# Altium schematic sheet кошколаз.SchDoc
size A4
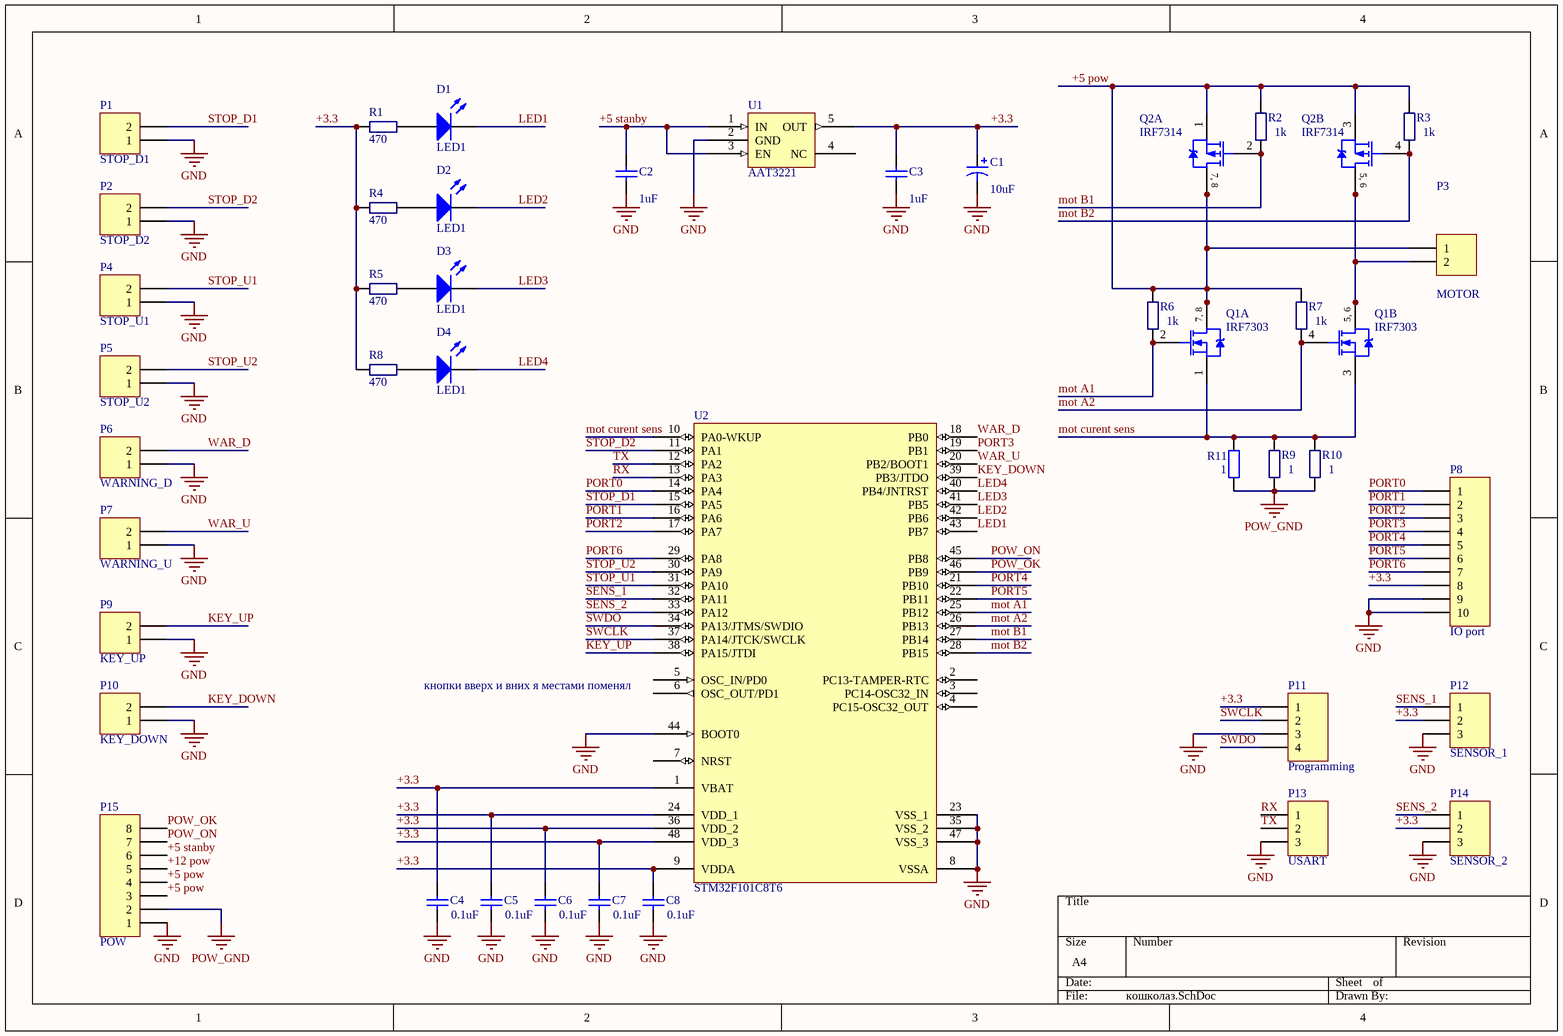
[diagram p0: кошколаз.SchDoc]

## Parts
C1  10uF  [C0805]
C2  1uF  [1608[0603]]
C3  1uF  [1608[0603]]
C4  0.1uF  [1608[0603]]
C5  0.1uF  [1608[0603]]
C6  0.1uF  [1608[0603]]
C7  0.1uF  [1608[0603]]
C8  0.1uF  [1608[0603]]
D1  LED1  [LED-1]
D2  LED1  [LED-1]
D3  LED1  [LED-1]
D4  LED1  [LED-1]
P1  STOP_D1  [HDR1X2]
P2  STOP_D2  [HDR1X2]
P3  MOTOR  [HDR1X2]
P4  STOP_U1  [HDR1X2]
P5  STOP_U2  [HDR1X2]
P6  WARNING_D  [HDR1X2]
P7  WARNING_U  [HDR1X2]
P8  IO port  [HDR1X10]
P9  KEY_UP  [HDR1X2]
P10  KEY_DOWN  [HDR1X2]
P11  Programming  [HDR1X4]
P12  SENSOR_1  [HDR1X3]
P13  USART  [HDR1X3]
P14  SENSOR_2  [HDR1X3]
P15  POW  [HDR1X8]
Q1  IRF7303  [SO-8_N]  (parts A,B of 2)
Q2  IRF7314  [SO-8_N]  (parts A,B of 2)
R1  470  [J1-0603]
R2  1k  [J1-0603]
R3  1k  [J1-0603]
R4  470  [J1-0603]
R5  470  [J1-0603]
R6  1k  [J1-0603]
R7  1k  [J1-0603]
R8  470  [J1-0603]
R9  1  [6-0805_N]
R10  1  [6-0805_N]
R11  1  [AXIAL-0.4]
U1  AAT3221  [SOT23-5]
U2  STM32F101C8T6  [LQFP48_M]

## Nets
GND: C1.2 C2.1 C3.1 C4.1 C5.1 C6.1 C7.1 C8.1 P1.1 P2.1 P4.1 P5.1 P6.1 P7.1 P8.9 P8.10 P9.1 P10.1 P11.3 P12.3 P13.3 P14.3 P15.1 U1.2(GND) U2.8(VSSA) U2.23(VSS_1) U2.35(VSS_2) U2.44(BOOT0) U2.47(VSS_3)
POW_GND: P15.2 R9.1 R10.1 R11.1
+3.3: C1.1 C3.2 C4.2 C5.2 C6.2 C7.2 C8.2 P8.8 P11.1 P12.2 P14.2 R1.2 R4.2 R5.2 R8.2 U1.5(OUT) U2.1(VBAT) U2.9(VDDA) U2.24(VDD_1) U2.36(VDD_2) U2.48(VDD_3)
+5 pow: P3.1 P15.3 P15.4 Q1.7(D) Q1.8(D) Q2.1(S) Q2.3(S) Q2.7(D) Q2.8(D) R2.2 R3.2 R6.2 R7.2
+5 stanby: C2.2 P15.6 U1.1(IN) U1.3(EN)
+12 pow: P15.5
KEY_DOWN: P10.2 U2.39(PB3/JTDO)
KEY_UP: P9.2 U2.38(PA15/JTDI)
LED1: D1.2(K) U2.43(PB7)
LED2: D2.2(K) U2.42(PB6)
LED3: D3.2(K) U2.41(PB5)
LED4: D4.2(K) U2.40(PB4/JNTRST)
mot A1: Q1.2(G) R6.1 U2.25(PB12)
mot A2: Q1.4(G) R7.1 U2.26(PB13)
mot B1: Q2.2(G) R2.1 U2.27(PB14)
mot B2: Q2.4(G) R3.1 U2.28(PB15)
mot curent sens: Q1.1(S) Q1.3(S) R9.2 R10.2 R11.2 U2.10(PA0-WKUP)
PORT0: P8.1 U2.14(PA4)
PORT1: P8.2 U2.16(PA6)
PORT2: P8.3 U2.17(PA7)
PORT3: P8.4 U2.19(PB1)
PORT4: P8.5 U2.21(PB10)
PORT5: P8.6 U2.22(PB11)
PORT6: P8.7 U2.29(PA8)
POW_OK: P15.8 U2.46(PB9)
POW_ON: P15.7 U2.45(PB8)
RX: P13.1 U2.13(PA3)
SENS_1: P12.1 U2.32(PA11)
SENS_2: P14.1 U2.33(PA12)
STOP_D1: P1.2 U2.15(PA5)
STOP_D2: P2.2 U2.11(PA1)
STOP_U1: P4.2 U2.31(PA10)
STOP_U2: P5.2 U2.30(PA9)
SWCLK: P11.2 U2.37(PA14/JTCK/SWCLK)
SWDO: P11.4 U2.34(PA13/JTMS/SWDIO)
TX: P13.2 U2.12(PA2)
WAR_D: P6.2 U2.18(PB0)
WAR_U: P7.2 U2.20(PB2/BOOT1)
NetD1_1: D1.1(A) R1.1
NetD2_1: D2.1(A) R4.1
NetD3_1: D3.1(A) R5.1
NetD4_1: D4.1(A) R8.1
NetP3_2: P3.2 Q1.5(D) Q1.6(D) Q2.5(D) Q2.6(D)

Not connected (* = marked no-connect by the designer): U1 4(NC); U2 2(PC13-TAMPER-RTC) 3(PC14-OSC32_IN) 4(PC15-OSC32_OUT) 5(OSC_IN/PD0) 6(OSC_OUT/PD1) 7(NRST)

## Notes on the sheet
- (near U2) кнопки вверх и вних я местами поменял
- (in symbol IRF7303, part A) 7, 8
- (in symbol IRF7303, part B) 5, 6
- (in symbol IRF7314, part A) 7, 8
- (in symbol IRF7314, part B) 5, 6

## Library data of the parts
C1 = Cap Pol3: Polarized Capacitor (Surface Mount); Published: 8-Jun-2000; LatestRevisionDate: 29-May-2009; LatestRevisionNote: IPC-7351 Footprint Added.; PackageReference: C0805; Publisher: Altium Limited; PackageDescription: Chip Capacitor; Value: 10uF
C2-C8 = Cap Semi: Capacitor (Semiconductor SIM Model); Published: 8-Jun-2000; LatestRevisionDate: 29-May-2009; LatestRevisionNote: IPC-7351 Footprint Added.; PackageReference: C1206; Publisher: Altium Limited; PackageDescription: Chip Capacitor
  C2 C3: Value: 1uF
  C4-C8: Value: 0.1uF
D1-D4 = LED1: Typical RED GaAs LED; Published: 8-Jun-2000; LatestRevisionDate: 08-Jul-2005; LatestRevisionNote: Mech Layer 1 removed.; PackageReference: LED-1; Publisher: Altium Limited; PackageDescription: LED; 2 Leads
P1-P7 P9 P10 = Header 2: Header, 2-Pin; LatestRevisionDate: 17-Jul-2002; LatestRevisionNote: Re-released for DXP Platform.; Publisher: Altium Limited
P8 = Header 10: Header, 10-Pin; LatestRevisionDate: 17-Jul-2002; LatestRevisionNote: Re-released for DXP Platform.; Publisher: Altium Limited
P11 = Header 4: Header, 4-Pin; LatestRevisionDate: 17-Jul-2002; LatestRevisionNote: Re-released for DXP Platform.; Publisher: Altium Limited
P12-P14 = Header 3: Header, 3-Pin; LatestRevisionDate: 17-Jul-2002; LatestRevisionNote: Re-released for DXP Platform.; Publisher: Altium Limited
P15 = Header 8: Header, 8-Pin; LatestRevisionDate: 17-Jul-2002; LatestRevisionNote: Re-released for DXP Platform.; Publisher: Altium Limited
Q1 = IRF7303: HEXFET Power MOSFET; Published: 8-Jun-2000; LatestRevisionDate: 13-Apr-2006; LatestRevisionNote: IPC-7351 Footprint Added.; DatasheetVersion: Aug-1997; PackageVersion: Feb-2001; PackageReference: SO-8; Publisher: Altium Limited; PackageDescription: 8-Pin Plastic Small Outline Integrated Circuit 1.27 mm Pitch; Code_JEDEC: MS-012-AA; Code_IPC: SOIC127P600-8; ComponentLink1Description: Manufacturer Link; ComponentLink1URL: http://www.irf.com/; ComponentLink2Description: Datasheet; ComponentLink2URL: http://www.irf.com/product-info/datasheets/data/irf7303.pdf
Q2 = IRF7314: HEXFET Power MOSFET; Published: 8-Jun-2000; LatestRevisionDate: 13-Apr-2006; LatestRevisionNote: IPC-7351 Footprint Added.; DatasheetVersion: Nov-1997; PackageVersion: Feb-2001; PackageReference: SO-8; Publisher: Altium Limited; PackageDescription: 8-Pin Plastic Small Outline Integrated Circuit 1.27 mm Pitch; Code_JEDEC: MS-012-AA; Code_IPC: SOIC127P600-8; ComponentLink1Description: Manufacturer Link; ComponentLink1URL: http://www.irf.com/; ComponentLink2Description: Datasheet; ComponentLink2URL: http://www.irf.com/product-info/datasheets/data/irf7314.pdf
R1-R10 = Res_SMD: Resistor; Published: 8-Jun-2000; LatestRevisionDate: 29-May-2009; LatestRevisionNote: IPC-7351 Footprint Added.; PackageReference: J1-0603; Publisher: Altium Limited; PackageDescription: Chip Resistor
  R1 R4 R5 R8: Value: 470
  R2 R3 R6 R7: Value: 1k
  R9 R10: Value: 1
R11 = Res2: Resistor; Published: 8-Jun-2000; LatestRevisionDate: 17-Jul-2002; LatestRevisionNote: Re-released for DXP Platform.; PackageReference: AXIAL-0.4; Publisher: Altium Limited; PackageDescription: Axial Device, Thru-Hole; 2 Leads; 0.4 in Pin Spacing; Value: 1
U1 = AAT3221: Low Dropout Linear Regulator
U2 = STM32F101C8T6: STM32 ARM-based 32-bit MCU with 64 Kbytes Flash, 48-pin LQFP, Industrial Temperature; Published: 30-May-2008; DatasheetVersion: rev6, Mar-2008; PackageVersion: Mar-2008; PackageReference: LQFP48; Publisher: Altium Limited; PackageDescription: 48-Pin Low-Profile Quad Flat Pack, 7 x 7 mm Body, 0.5 mm Pitch (LQFP48); ComponentLink1Description: Manufacturer Link; ComponentLink1URL: www.st.com/stm32; ComponentLink2Description: Datasheet; ComponentLink2URL: http://www.st.com/stonline/products/literature/ds/13586.pdf